# Altium project BMS029B.PrjPcb (part 1 of 2)
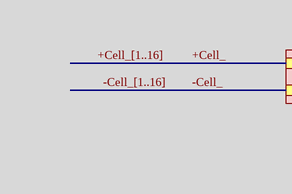
[diagram p0: BMS029B_Monitor.SchDoc, top left]
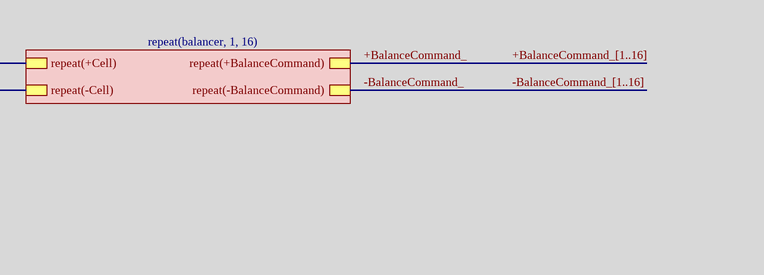
[diagram p1: BMS029B_Monitor.SchDoc, top right]
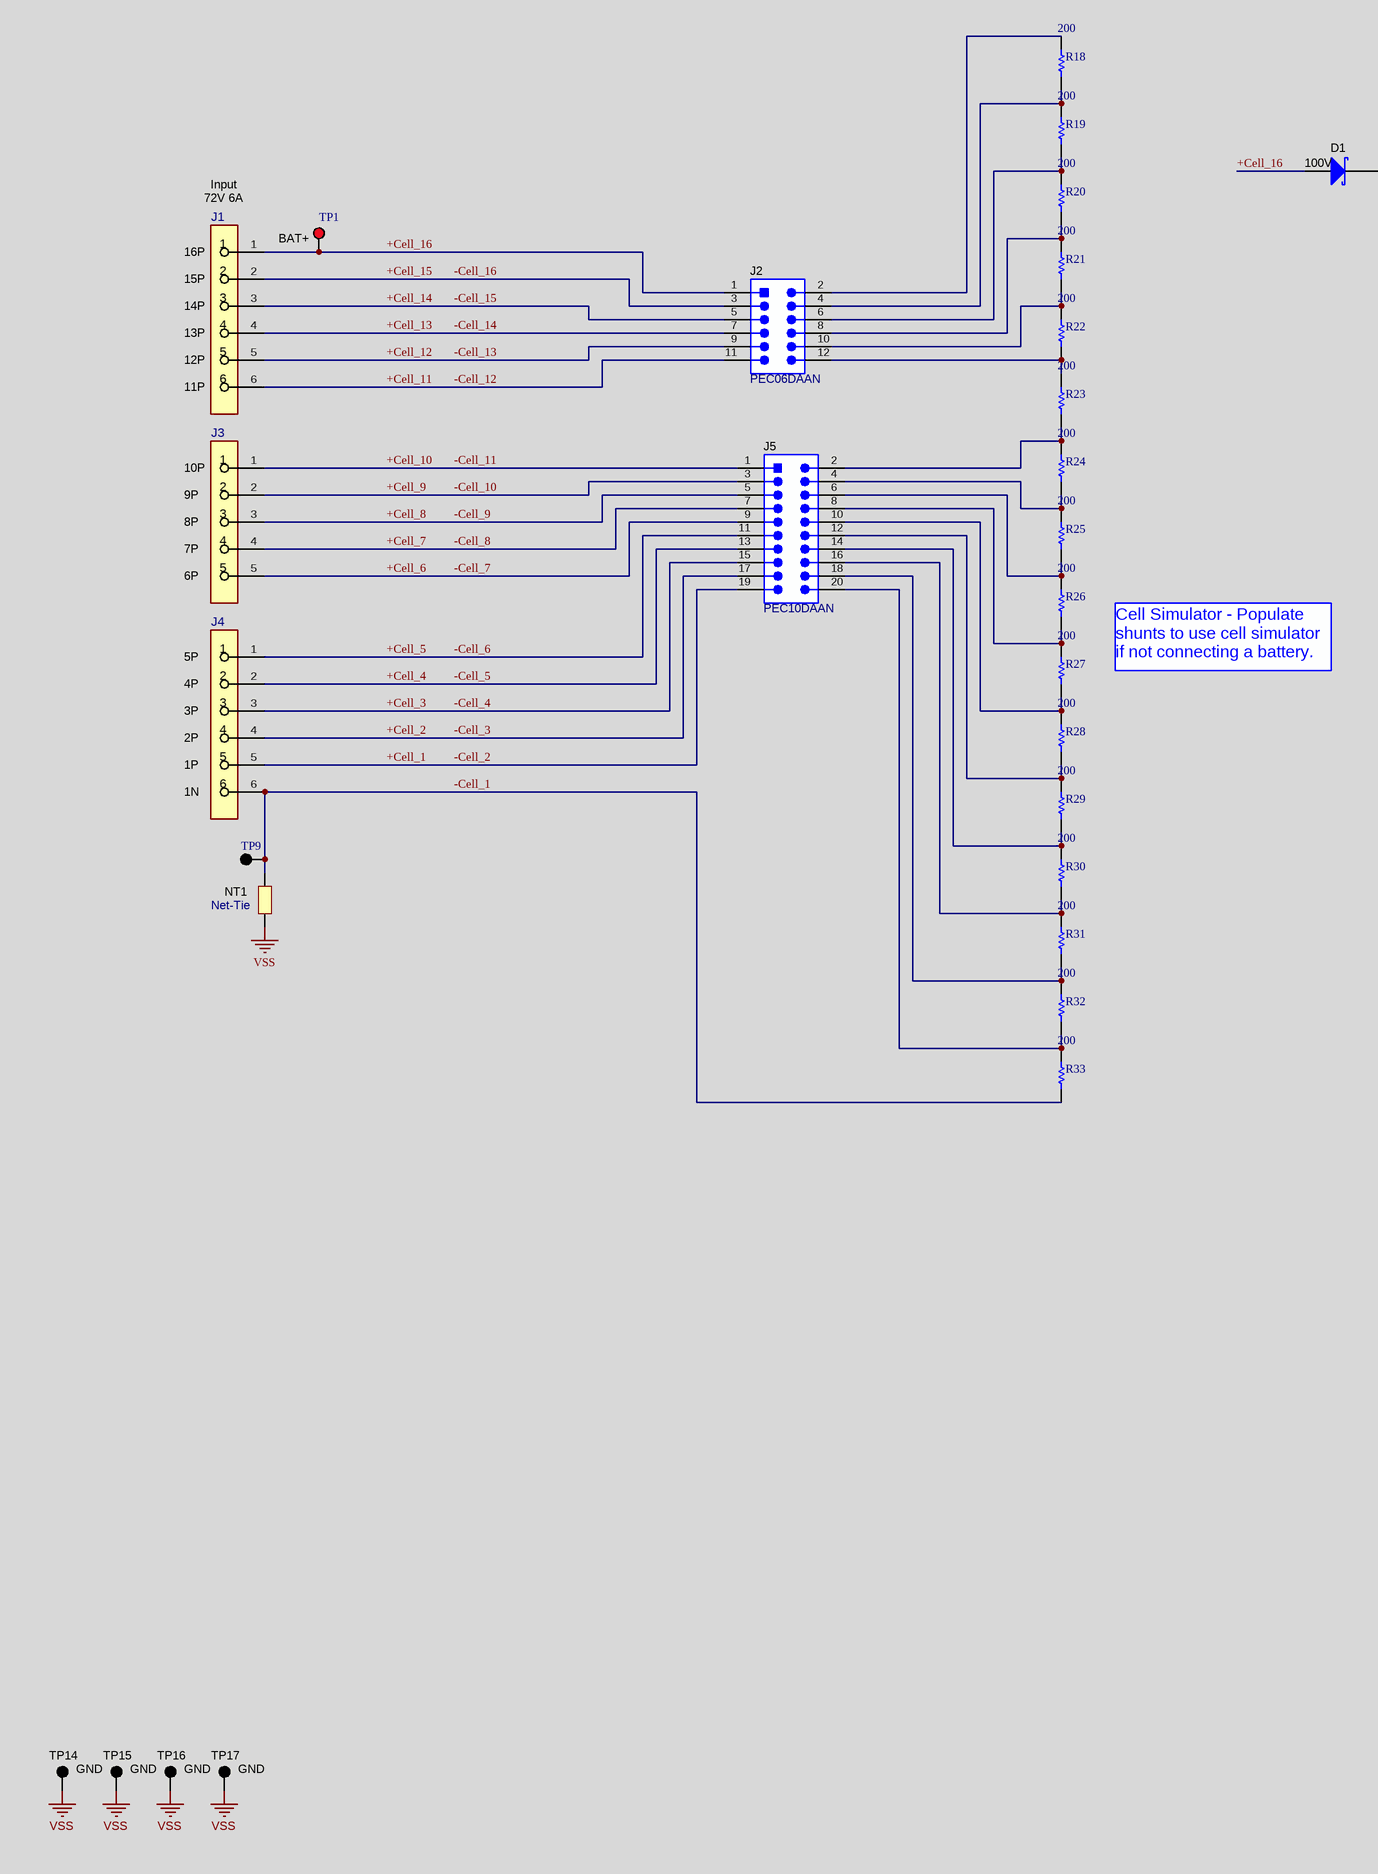
[diagram p2: BMS029B_Monitor.SchDoc, bottom left]
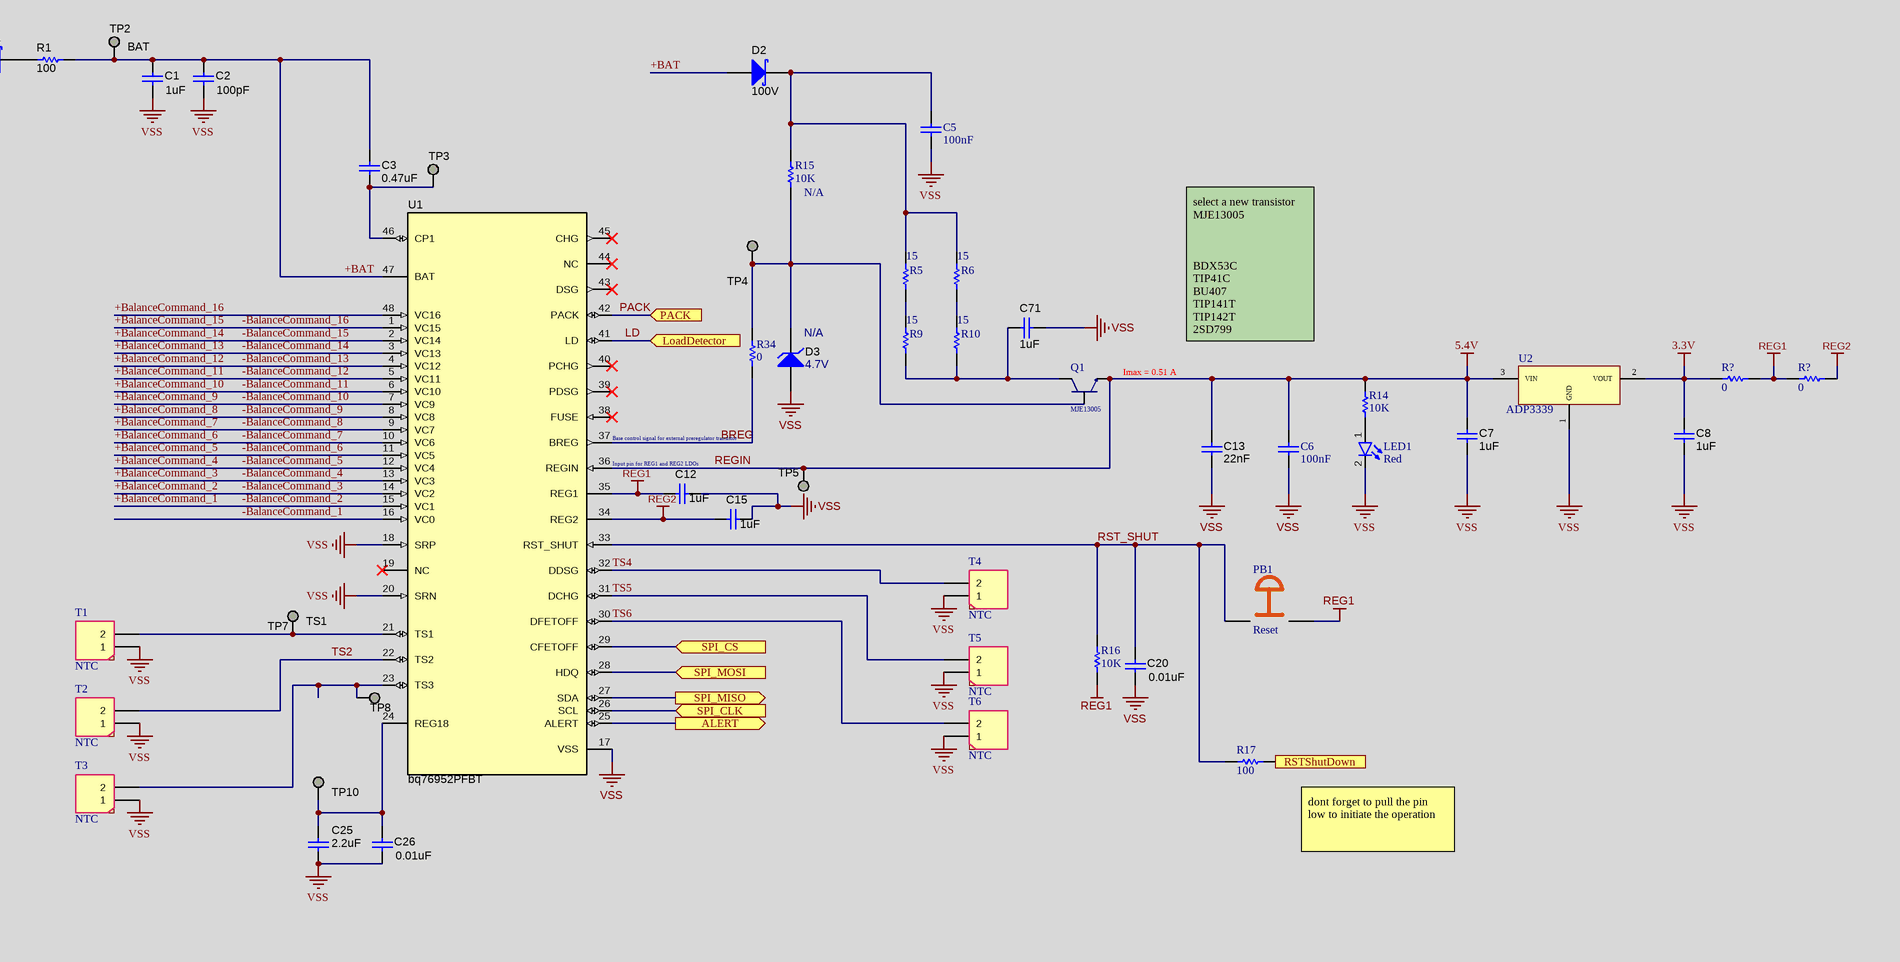
[diagram p3: BMS029B_Monitor.SchDoc, bottom right]
PCB_Rev: B; PRJ_Customer: Public Release; PRJ_Number: BMS029; PRJ_Title: BQ76952EVM; SCH_Rev: B; TID: N/A
4 sheets, 328 parts. Net scope: hierarchical (ports join the sheet entries above them; power ports are global).
Board file: BMS_slave.PcbDoc
Sheets:
  BMS029B_Monitor.SchDoc
    balancer1 = balancer.SchDoc
    balancer2 = balancer.SchDoc
    balancer3 = balancer.SchDoc
    balancer4 = balancer.SchDoc
    balancer5 = balancer.SchDoc
    balancer6 = balancer.SchDoc
    balancer7 = balancer.SchDoc
    balancer8 = balancer.SchDoc
    balancer9 = balancer.SchDoc
    balancer10 = balancer.SchDoc
    balancer11 = balancer.SchDoc
    balancer12 = balancer.SchDoc
    balancer13 = balancer.SchDoc
    balancer14 = balancer.SchDoc
    balancer15 = balancer.SchDoc
    balancer16 = balancer.SchDoc
  BMS029B_Interface.SchDoc
  BMS029B_Hardware.SchDoc

## Sheet BMS029B_Monitor.SchDoc: Monitor
size A1; Date: Not shown in title block; ApprovedBy: Not shown in title block; CheckedBy: Not shown in title block; Author: Not shown in title block; CompanyName: Not shown in title block; Engineer: Not shown in title block; Organization: Not shown in title block; Address1: Not shown in title block; Address2: Not shown in title block; Address3: Not shown in title block; Address4: Not shown in title block; DocumentNumber: 1; Revision: Use project parameter SCH_Rev; SheetNumber: 1; SheetTotal: 5; PageSetup: Record=PageOptions|CenterHorizontal=True|CenterVertical=True|PrintScale=1.00|XCorrection=1.00|YCorrection=1.00|PrintKind=0|BorderSize=5000000|LeftOffset=0|BottomOffset=0|Orientation=2|PaperLength=1000|PaperWidth=1000|Scale=100|PaperSource=15|PrintQuality=600|MediaType=1|DitherType=10|PaperKind=Letter|PrintScaleMode=1; CurrentTime: Not shown in title block; CurrentDate: Not shown in title block; Time: Not shown in title block; DocumentFullPathAndName: Not shown in title block; DocumentName: Not shown in title block; ModifiedDate: Not shown in title block; ImagePath: Not shown in title block

### Parts
(Parts that share a designator on the sheet are numbered #1, #2 ... from top to bottom, then left to right.)
C1  ValueDisplayed: 1uF  [1206_180]  (hidden comment: C3216X7R2A105K160AA)
C2  ValueDisplayed: 100pF  [0603]  (hidden comment: GCM1885C2A101JA16D)
C3  ValueDisplayed: 0.47uF  [0805_HV]  (hidden comment: GCM219R71E474KA55D)
C5  100nF  [CAPC0603]
C6  100nF  [CAPC0603]
C7  ValueDisplayed: 1uF  [0805_HV]  (hidden comment: EMK212B7105KG-T)
C8  ValueDisplayed: 1uF  [0805_HV]  (hidden comment: EMK212B7105KG-T)
C12  ValueDisplayed: 1uF  [0805_HV]  (hidden comment: EMK212B7105KG-T)
C13  Cap_F: 22nF  [0603]  (hidden comment: C0603C223K4RACTU)
C15  ValueDisplayed: 1uF  [0805_HV]  (hidden comment: EMK212B7105KG-T)
C20  ValueDisplayed: 0.01uF  [0603]  (hidden comment: 885012206040)
C25  ValueDisplayed: 2.2uF  [0805_HV]  (hidden comment: EMK212B7225KG-T)
C26  ValueDisplayed: 0.01uF  [0603]  (hidden comment: 885012206040)
C71  ValueDisplayed: 1uF  [1206_180]  (hidden comment: C3216X7R2A105K160AA)
D1  value 100V  [SOD-123]  (hidden comment: BAT46W-7-F)
D2  value 100V  [SOD-123]  (hidden comment: BAT46W-7-F)
D3  N/A  value 4.7V  [ZENER]
J1  OSTTE060161  [FP-OSTTE060161_HDR6-MFG]  (value not drawn)
J2  PEC06DAAN  [CONN_PEC06DAAN]
J3  OSTTE050161  [FP-OSTTE050161_HDR5-MFG]  (value not drawn)
J4  OSTTE060161  [FP-OSTTE060161_HDR6-MFG]  (value not drawn)
J5  PEC10DAAN  [SULLINS_PEC10DAAN]
LED1  Red  [LED SMD 1206]
NT1  Net-Tie  [Net-Tie_10milWide_30milLong]  (net tie, no BOM)
PB1  Reset  [SWITCH-PB4]
Q1  Transistor: MJE13005  [dpak]  (hidden comment: NPN transistor)
R1  ValueDisplayed: 100  [0603]  (hidden comment: Resistor)
R5  15  [RES2512]
R6  15  [RESC0603]
R9  15  [RESC0603]
R10  15  [RESC0603]
R14  10K  [RES0603]
R15  N/A  value 10K  [RES0603]
R16  10K  [RES0603]
R17  100  [RES0603]
R18  200  [RESC0603]
R19  200  [RESC0603]
R20  200  [RESC0603]
R21  200  [RESC0603]
R22  200  [RESC0603]
R23  200  [RESC0603]
R24  200  [RESC0603]
R25  200  [RESC0603]
R26  200  [RESC0603]
R27  200  [RESC0603]
R28  200  [RESC0603]
R29  200  [RESC0603]
R30  200  [RESC0603]
R31  200  [RESC0603]
R32  200  [RESC0603]
R33  200  [RESC0603]
R34  0  [RES0603]
R?#1  0  [RES0603]
R?#2  0  [RES0603]
T1  NTC  [HEADER1*2]
T2  NTC  [HEADER1*2]
T3  NTC  [HEADER1*2]
T4  NTC  [HEADER1*2]
T5  NTC  [HEADER1*2]
T6  NTC  [HEADER1*2]
TP1  TESTPOINT  [Keystone5010]  (value not drawn)
TP2  TESTPOINT  [TP_VIA_060RND040]  (value not drawn)  (no BOM)
TP3  TESTPOINT  [TP_VIA_060RND040]  (value not drawn)  (no BOM)
TP4  TESTPOINT  [TP_VIA_060RND040]  (value not drawn)  (no BOM)
TP5  TESTPOINT  [TP_VIA_060RND040]  (value not drawn)  (no BOM)
TP7  TESTPOINT  [TP_VIA_060RND040]  (value not drawn)  (no BOM)
TP8  TESTPOINT  [TP_VIA_060RND040]  (value not drawn)  (no BOM)
TP9  TESTPOINT  [Keystone5011]  (value not drawn)
TP10  TESTPOINT  [TP_50MIL-25MILHOLE]  (value not drawn)  (no BOM)
TP14  5006  [Keystone5006]  (value not drawn)
TP15  5006  [Keystone5006]  (value not drawn)
TP16  5006  [Keystone5006]  (value not drawn)
TP17  5006  [Keystone5006]  (value not drawn)
U1  bq76952PFBT  [PFB0048A_N]
U2  ADP3339  [AMS1117]

### Sub-sheets
repeat(balancer, 1, 16) = balancer.SchDoc: repeat(+Cell), repeat(+BalanceCommand), repeat(-Cell), repeat(-BalanceCommand)

### Ports
ALERT (out), LoadDetector (in), PACK (in), RSTShutDown (in), SPI_CLK (in), SPI_CS (in), SPI_MISO (out), SPI_MOSI (in)

### Nets
3.3V: C8.2 R?#1.1 U2.2(VOUT)
REG1: C12.2 PB1.2 R16.2 R?#1.2 R?#2.1 U1.35(REG1)
REG2: C15.2 R?#2.2 U1.34(REG2)
REGIN: C6.2 C7.2 C13.2 Q1.2(E) R14.1 TP5.1 U1.36(REGIN) U2.3(VIN)  [also labelled 5.4V]
VSS: C1.2 C2.2 C5.1 C6.1 C7.1 C8.1 C12.1 C13.1 C15.1 C20.2 C25.1 C26.2 C71.2 D3.2(A) LED1.2(K) NT1.1 T1.1 T2.1 T3.1 T4.1 T5.1 T6.1 TP14.1 TP15.1 TP16.1 TP17.1 U1.17(VSS) U1.18(SRP) U1.20(SRN) U2.1(GND)
+BalanceCommand_: sheet repeat(balancer, 1, 16)/repeat(+BalanceCommand)
+BalanceCommand_1: U1.15(VC1)  [also labelled -BalanceCommand_2]
+BalanceCommand_2: U1.14(VC2)  [also labelled -BalanceCommand_3]
+BalanceCommand_3: U1.13(VC3)  [also labelled -BalanceCommand_4]
+BalanceCommand_4: U1.12(VC4)  [also labelled -BalanceCommand_5]
+BalanceCommand_5: U1.11(VC5)  [also labelled -BalanceCommand_6]
+BalanceCommand_6: U1.10(VC6)  [also labelled -BalanceCommand_7]
+BalanceCommand_7: U1.9(VC7)  [also labelled -BalanceCommand_8]
+BalanceCommand_8: U1.8(VC8)  [also labelled -BalanceCommand_9]
+BalanceCommand_9: U1.7(VC9)  [also labelled -BalanceCommand_10]
+BalanceCommand_10: U1.6(VC10)  [also labelled -BalanceCommand_11]
+BalanceCommand_11: U1.5(VC11)  [also labelled -BalanceCommand_12]
+BalanceCommand_12: U1.4(VC12)  [also labelled -BalanceCommand_13]
+BalanceCommand_13: U1.3(VC13)  [also labelled -BalanceCommand_14]
+BalanceCommand_14: U1.2(VC14)  [also labelled -BalanceCommand_15]
+BalanceCommand_15: U1.1(VC15)  [also labelled -BalanceCommand_16]
+BalanceCommand_16: U1.48(VC16)
+BAT: C1.1 C2.1 C3.1 D2.2(A) R1.1 TP2.1 U1.47(BAT)
+Cell_: sheet repeat(balancer, 1, 16)/repeat(+Cell)
+Cell_1: J4.5 J5.19  [also labelled -Cell_2]
+Cell_2: J4.4 J5.17  [also labelled -Cell_3]
+Cell_3: J4.3 J5.15  [also labelled -Cell_4]
+Cell_4: J4.2 J5.13  [also labelled -Cell_5]
+Cell_5: J4.1 J5.11  [also labelled -Cell_6]
+Cell_6: J3.5 J5.9  [also labelled -Cell_7]
+Cell_7: J3.4 J5.7  [also labelled -Cell_8]
+Cell_8: J3.3 J5.5  [also labelled -Cell_9]
+Cell_9: J3.2 J5.3  [also labelled -Cell_10]
+Cell_10: J3.1 J5.1  [also labelled -Cell_11]
+Cell_11: J1.6 J2.11  [also labelled -Cell_12]
+Cell_12: J1.5 J2.9  [also labelled -Cell_13]
+Cell_13: J1.4 J2.7  [also labelled -Cell_14]
+Cell_14: J1.3 J2.5  [also labelled -Cell_15]
+Cell_15: J1.2 J2.3  [also labelled -Cell_16]
+Cell_16: D1.2(A) J1.1 J2.1 TP1.1
-BalanceCommand_: sheet repeat(balancer, 1, 16)/repeat(-BalanceCommand)
-BalanceCommand_1: U1.16(VC0)
-Cell_: sheet repeat(balancer, 1, 16)/repeat(-Cell)
-Cell_1: J4.6 NT1.2 R33.1 TP9.1
ALERT: U1.25(ALERT) ; port ALERT
BREG: R34.2 U1.37(BREG)
LD: U1.41(LD) ; port LoadDetector
PACK: U1.42(PACK) ; port PACK
RST_SHUT: C20.1 PB1.1 R16.1 R17.1 U1.33(RST_SHUT)
RSTShutDown: R17.2 ; port RSTShutDown
SPI_CLK: U1.26(SCL) ; port SPI_CLK
SPI_CS: U1.29(CFETOFF) ; port SPI_CS
SPI_MISO: U1.27(SDA) ; port SPI_MISO
SPI_MOSI: U1.28(HDQ) ; port SPI_MOSI
TS2: T2.2 U1.22(TS2)
TS4: T4.2 U1.32(DDSG)
TS5: T5.2 U1.31(DCHG)
TS6: T6.2 U1.30(DFETOFF)
NetC3_2: C3.2 TP3.1 U1.46(CP1)
NetC5_2: C5.2 D2.1(K) R5.2 R6.2 R15.1
NetC25_2: C25.2 C26.1 TP10.1 U1.24(REG18)
NetC71_1: C71.1 Q1.3(C) R9.1 R10.1
NetD1_1: D1.1(K) R1.2
NetD3_1: D3.1(K) Q1.1(B) R15.2 R34.1 TP4.1
NetJ2_2: J2.2 R18.2
NetJ2_4: J2.4 R18.1 R19.2
NetJ2_6: J2.6 R19.1 R20.2
NetJ2_8: J2.8 R20.1 R21.2
NetJ2_10: J2.10 R21.1 R22.2
NetJ2_12: J2.12 R22.1 R23.2
NetJ5_2: J5.2 R23.1 R24.2
NetJ5_4: J5.4 R24.1 R25.2
NetJ5_6: J5.6 R25.1 R26.2
NetJ5_8: J5.8 R26.1 R27.2
NetJ5_10: J5.10 R27.1 R28.2
NetJ5_12: J5.12 R28.1 R29.2
NetJ5_14: J5.14 R29.1 R30.2
NetJ5_16: J5.16 R30.1 R31.2
NetJ5_18: J5.18 R31.1 R32.2
NetJ5_20: J5.20 R32.1 R33.2
NetLED1_1: LED1.1(A) R14.2
NetR5_1: R5.1 R9.2
NetR6_1: R6.1 R10.2
NetT1_2: T1.2 TP7.1 U1.21(TS1)
NetT3_2: T3.2 TP8.1 U1.23(TS3)

Not connected (* = marked no-connect by the designer): U1 19(NC)* 38(FUSE)* 39(PDSG)* 40(PCHG)* 43(DSG)* 44(NC)* 45(CHG)*

### Buses and harness runs
bus +BalanceCommand_[1..16]
bus +Cell_[1..16]
bus -BalanceCommand_[1..16]
bus -Cell_[1..16]

### Notes on the sheet
- Input
- BAT
- (near J1) 16P
- (near J1) 72V 6A
- (near TP1) BAT+
- (near J1) 15P
- (near J1) 14P
- (near J1) 13P
- (near J1) 12P
- (near J1) 11P
- (near J3) 9P
- (near J3) 8P
- (near J3) 10P
- (near Q1) Imax = 0.51 A
- select a new transistor
  MJE13005
  BDX53C
  TIP41C
  BU407
  TIP141T
  TIP142T
  2SD799
- (near J3) 6P
- (near J3) 7P
- (near U1) Base control signal for external preregulator transistor
- (near J4) 5P
- Input pin for REG1 and REG2 LDOs
- (near J4) 4P
- (near J4) 3P
- Cell Simulator - Populate shunts to use cell simulator if not connecting a battery.
- (near J4) 2P
- (near J4) 1P
- (near J4) 1N
- (near TP7) TS1
- (near R17) dont forget to pull the pin low to initiate the operation
- GND
- (near TP17) GND

### Library data of the parts
C1 C71 = CMP-0008710-2: CAP, CERM, 1 uF, 100 V, +/- 10%, X7R, 1206; Manufacturer: TDK; TaMin_C: -55°C; ESR_ohm: 4.575m; Polarized: N; SizeAreaWB_mm2: 10.92; Value1: 0.004575 ohm; U/M: EA; Value: 1uF; TaMax_C: 125°C; SizeZ_mm: 1.8; SizeX_mm: 3.2; SizeY_mm: 1.6; Value2: 100V; SizeArea_mm2: 5.12; Cap_F: 1µF; IRMS_A: 3.39639A; AEC Category: Q200; Supplier Part Number 2: 810-C3216X7R2A105K160AA; Publisher: Texas Instruments; Supplier 2: Mouser; TempCo: X7R; Published: 2008-06-19; RoHS: Y; MountType: SMT; Supplier 1: Digi-Key; PackageReference: 1206; Tolerance_%: 10%; Cap_Case: 1206_180; CompType: Capacitor; LatestRevisionDate: 2017-03-09; PartNumber: C3216X7R2A105K160AA; AEC Qualified: N; VDC_V: 100V; ComponentLink1Description: Datasheet link; AEC Grade: N/A; Supplier Part Number 1: 445-4467-1-ND; Technology: Ceramic; ComponentLink1URL: https://product.tdk.com/en/search/capacitor/ceramic/mlcc/info?part_no=C3216X7R2A105K160AA
C2 = CMP-0007130-4: CAP, CERM, 100 pF, 100 V, +/- 5%, C0G/NP0, AEC-Q200 Grade 1, 0603; Manufacturer: MuRata; TaMin_C: -55°C; Polarized: N; SizeAreaWB_mm2: 4.68; Value1: Unknown; U/M: EA; TaMax_C: 125°C; SizeZ_mm: 1; SizeX_mm: 1.6; SizeY_mm: 0.8; Value2: 100V; SizeArea_mm2: 1.28; AEC Qualified: Y; AEC Category: Q200; Value: 100pF; Supplier Part Number 2: 81-GCM1885C2A101JA6D; Publisher: Texas Instruments; Supplier 2: Mouser; TempCo: C0G/NP0; Published: 2008-06-19; RoHS: Y; MountType: SMT; Supplier 1: Digi-Key; PackageReference: 0603; Tolerance_%: 5%; Cap_Case: 0603; CompType: Capacitor; LatestRevisionDate: 2017-03-09; PartNumber: GCM1885C2A101JA16D; Cap_F: 100pF; VDC_V: 100V; ComponentLink1Description: Datasheet link; AEC Grade: 1; Supplier Part Number 1: 490-4771-1-ND; Technology: Ceramic; ComponentLink1URL: http://psearch.murata.com/capacitor/product/GCM1885C2A101JA16%23.pdf
C3 = CMP-0008010-2: CAP, CERM, 0.47 uF, 25 V, +/- 10%, X7R, AEC-Q200 Grade 1, 0805; Manufacturer: MuRata; TaMin_C: -55°C; Polarized: N; SizeAreaWB_mm2: 6.75; Value1: Unknown; U/M: EA; Value: 0.47uF; TaMax_C: 125°C; SizeZ_mm: 1.45; SizeX_mm: 2; SizeY_mm: 1.25; Cap_Case: 0805; Value2: 25V; SizeArea_mm2: 2.5; AEC Qualified: Y; Cap_F: 470nF; AEC Grade: 1; AEC Category: Q200; Supplier Part Number 2: 81-GCM219R71E474KA5D; Publisher: Texas Instruments; Supplier 2: Mouser; TempCo: X7R; Published: 2008-06-19; RoHS: Y; MountType: SMT; Supplier 1: Digi-Key; PackageReference: 0805; Tolerance_%: 10%; CompType: Capacitor; LatestRevisionDate: 2017-03-09; PartNumber: GCM219R71E474KA55D; VDC_V: 25V; ComponentLink1Description: Datasheet link; Supplier Part Number 1: 490-8044-1-ND; Technology: Ceramic; ComponentLink1URL: http://psearch.murata.com/capacitor/product/GCM219R71E474KA55%23.pdf
C5 C6 = Capacitor: Published: 8-Jun-2000; LatestRevisionDate: 17-Jul-2002; LatestRevisionNote: Re-released for DXP Platform.; PackageReference: C0805; Publisher: Altium Limited; Value: 100nF
C7 C8 C12 C15 = CMP-0008000-2: CAP, CERM, 1 uF, 16 V, +/- 10%, X7R, 0805; Manufacturer: Taiyo Yuden; TaMin_C: -55°C; Polarized: N; SizeAreaWB_mm2: 6.75; Value1: Unknown; U/M: EA; Value: 1uF; TaMax_C: 125°C; SizeZ_mm: 1.45; SizeX_mm: 2; SizeY_mm: 1.25; Cap_Case: 0805; Value2: 16V; SizeArea_mm2: 2.5; Cap_F: 1µF; AEC Category: Q200; Supplier Part Number 2: 1683653; Publisher: Texas Instruments; Supplier 2: Farnell; TempCo: X7R; Published: 2008-06-19; RoHS: Y; MountType: SMT; Supplier 1: Digi-Key; PackageReference: 0805; Tolerance_%: 10%; CompType: Capacitor; LatestRevisionDate: 2017-03-09; PartNumber: EMK212B7105KG-T; AEC Qualified: ?; VDC_V: 16V; ComponentLink1Description: Datasheet link; Supplier Part Number 1: 587-1283-1-ND; Technology: Ceramic; ComponentLink1URL: http://www.yuden.co.jp/ut/product/pdf/djmk_e.pdf
C13 = CMP-0006900-4: CAP, CERM, 0.022 uF, 16 V, +/- 10%, X7R, 0603; Manufacturer: Kemet; TaMin_C: -55°C; Polarized: N; SizeAreaWB_mm2: 4.68; Value1: Unknown; U/M: EA; TaMax_C: 125°C; SizeZ_mm: 1; SizeX_mm: 1.6; SizeY_mm: 0.8; Value2: 16V; SizeArea_mm2: 1.28; AEC Category: Q200; Supplier Part Number 2: 80-C0603C223K4R; Publisher: Texas Instruments; Supplier 2: Mouser; TempCo: X7R; Published: 2008-06-19; RoHS: Y; MountType: SMT; Value: 0.022uF; Supplier 1: Digi-Key; PackageReference: 0603; Tolerance_%: 10%; Cap_Case: 0603; CompType: Capacitor; LatestRevisionDate: 2017-03-09; PartNumber: C0603C223K4RACTU; AEC Qualified: ?; VDC_V: 16V; ComponentLink1Description: Datasheet link; Supplier Part Number 1: 399-1093-1-ND; Technology: Ceramic; ValueDisplayed: 0.022uF; ComponentLink1URL: http://www.kemet.com/kemet/web/homepage/kechome.nsf/vapubfiles/F3102_Y5V.pdf/$file/F3102_Y5V.pdf; Supplier 3: Farnell; Supplier Part Number 3: 1204523
C20 C26 = CMP-0006828-4: CAP, CERM, 0.01 uF, 16 V, +/- 10%, X7R, 0603; Manufacturer: Wurth Elektronik; TaMin_C: -55°C; Polarized: N; SizeAreaWB_mm2: 4.68; Value1: Unknown; U/M: EA; Value: 0.01uF; TaMax_C: 125°C; SizeZ_mm: 1; SizeX_mm: 1.6; SizeY_mm: 0.8; Value2: 16V; SizeArea_mm2: 1.28; Cap_F: 10nF; AEC Category: Q200; Supplier Part Number 2: 710-885012206040; Publisher: Texas Instruments; Supplier 2: Mouser; TempCo: X7R; Published: 2008-06-19; RoHS: Y; MountType: SMT; Supplier 1: Digi-Key; PackageReference: 0603; Tolerance_%: 10%; Cap_Case: 0603; CompType: Capacitor; LatestRevisionDate: 2017-03-09; PartNumber: 885012206040; AEC Qualified: N; VDC_V: 16V; ComponentLink1Description: Datasheet link; AEC Grade: N/A; Supplier Part Number 1: 732-7959-1-ND; Technology: Ceramic; ComponentLink1URL: http://katalog.we-online.de/pbs/datasheet/885012206040.pdf
C25 = CMP-0008001-2: CAP, CERM, 2.2 uF, 16 V, +/- 10%, X7R, 0805; Manufacturer: Taiyo Yuden; TaMin_C: -55°C; Polarized: N; SizeAreaWB_mm2: 6.75; Value1: Unknown; U/M: EA; Value: 2.2uF; TaMax_C: 125°C; SizeZ_mm: 1.45; SizeX_mm: 2; SizeY_mm: 1.25; Cap_Case: 0805; Value2: 16V; SizeArea_mm2: 2.5; Cap_F: 2.2µF; AEC Category: Q200; Supplier Part Number 2: 1683654; Publisher: Texas Instruments; Supplier 2: Farnell; TempCo: X7R; Published: 2008-06-19; RoHS: Y; MountType: SMT; Supplier 1: Digi-Key; PackageReference: 0805; Tolerance_%: 10%; CompType: Capacitor; LatestRevisionDate: 2017-03-09; PartNumber: EMK212B7225KG-T; AEC Qualified: ?; VDC_V: 16V; ComponentLink1Description: Datasheet link; Supplier Part Number 1: 587-1431-1-ND; Technology: Ceramic; ComponentLink1URL: http://www.yuden.co.jp/ut/product/pdf/djmk_e.pdf
D1 D2 = CMP-0028450-2: Diode, Schottky, 100 V, 0.15 A, SOD-123; Manufacturer: Diodes Inc.; Io_A: 150mA; SizeArea_mm2: 6.545; SizeX_mm: 3.85; Value2: 0.6V; Value1: 0.15A; AEC Category: Q101; SizeZ_mm: 1.35; SizeY_mm: 1.7; Green_Lifecycle: Active; Green_REACh: Passed; SizeAreaWB_mm2: 13.095; Vf_V: 600mV; ComponentLink1Description: Datasheet link; MountType: SMT; ComponentLink1URL: http://www.diodes.com/datasheets/ds30044.pdf; Vr_V: 100V; PartNumber: BAT46W-7-F; Type: Schottky; AEC Qualified: ?; Green_EU RoHS-2: Passed; Green_EU RoHS: Passed; CompType: Diode; RoHS: Y; PackageReference: SOD-123
D3 = CMP-0005740-3: Diode, Zener, 4.7 V, 500 mW; Manufacturer: ON Semiconductor; PartNumber: MMSZ4697T1G; SizeY_mm: 1.7; SizeX_mm: 3.85; RJA_CperW: 340; SizeAreaWB_mm2: 13.095; AEC Category: Q101; Power_W: 500mW; SizeZ_mm: 1.35; Vz_V: 10V; Value1: 0.5W; SizeArea_mm2: 6.545; PackageReference: SOD-123; AEC Qualified: ?; MountType: SMT; RoHS: Y; ComponentLink1Description: Datasheet link; CompType: Zener; ComponentLink1URL: http://www.onsemi.com/pub_link/Collateral/MMSZ4678T1-D.PDF
J1 J4 = CMP-0087050-1: TERM BLOCK 3.5MM VERT 6POS PCB; Manufacturer: On Shore Technology; ContactFinish: Tin; Current_A: 10A; Voltage_V: 300V; Row_Count: 1; PinCount: 6; RoHS: TRUE; ComponentLink1URL: http://www.on-shore.com/wp-content/uploads/2019/02/OSTTEXX0161.pdf; ComponentLink1Description: Datasheet; PartNumber: OSTTE060161; Symbol Name: SYM-OSTTE060161; PackageReference: HDR6
J2 = CMP-0054551-2: Header, 100mil, 6x2, Tin, TH; Manufacturer: Sullins Connector Solutions; Current_A: 3A; Green_Lifecycle: Not Set; Shrouded: N; Gender: Male; Green_REACh: Incomplete; Voltage_V: 1.8kV; Row_Count: 2; RowSpacing_mm: 2.54; Cert_UL: Y; ComponentLink1URL: http://www.sullinscorp.com/catalogs/77_PAGE108-109_.100_MALE_HDR.pdf; ClassName: Header; Color: Black; RoHS: Y; MountType: TH; Green_EU RoHS-2: Incomplete; Supplier 1: Digi-Key; Green_EU RoHS: Incomplete; PackageReference: Header, 6x2, 100mil, Tin; PinCount: 12; CompType: Header; PartNumber: PEC06DAAN; Orientation: Vertical; ComponentLink1Description: Datasheet URL; Supplier Part Number 1: S2012E-06-ND; Pitch_mm: 2.54; ContactFinish: Tin
J3 = CMP-0087049-1: TERM BLOCK 3.5MM VERT 5POS PCB; Manufacturer: On Shore Technology; Row_Count: 1; ContactFinish: Tin; Current_A: 10A; Voltage_V: 300V; ComponentLink1Description: Datasheet; PinCount: 5; PartNumber: OSTTE050161; RoHS: TRUE; PackageReference: HDR5; Symbol Name: SYM-OSTTE050161; ComponentLink1URL: http://www.on-shore.com/wp-content/uploads/2019/02/OSTTEXX0161.pdf
J5 = CMP-0054623-2: Header, 2.54mm, 10x2, Tin, TH; Manufacturer: Sullins Connector Solutions; Current_A: 3A; Green_Lifecycle: Not Set; Shrouded: N; Gender: Male; Green_REACh: Incomplete; Row_Count: 2; RowSpacing_mm: 2.54; Cert_UL: Y; ComponentLink1URL: https://drawings-pdf.s3.amazonaws.com/C10419.pdf; ClassName: Header; Color: Black; RoHS: Y; MountType: TH; Green_EU RoHS-2: Incomplete; Supplier 1: Digi-Key; Green_EU RoHS: Incomplete; PackageReference: Header, 10x2, 2.54mm, TH; PinCount: 20; CompType: Header; PartNumber: PEC10DAAN; Orientation: Vertical; ComponentLink1Description: Datasheet URL; Supplier Part Number 1: S2012E-10-ND; Pitch_mm: 2.54; ContactFinish: Tin
LED1 = LED: Designer: Saeid Jorablo; Organazation: ControTec; Adding Date: 1387/12/22; Color: Red; Size: SMD 0603
NT1 = CMP-0078142-3: Single point connection between nets.; MountType: SMT; PackageReference: N/A; CompType: Net-Tie; Library Reference: Net-Tie; Manufacturer: N/A; PartNumber: N/A
PB1 = Swtich-PB4: 4-Pin Push Button
Q1 = BC817: 45 V, 0.5 A
R1 = CMP-0025700-4: RES, 100, 5%, 0.1 W, AEC-Q200 Grade 0, 0603; PartNumber: CRCW0603100RJNEA; Manufacturer: Vishay-Dale; Value: 100; Value_Code: 100R; Power_W: 100mW; Value2: 0.1W; VDC_V: 75V; TempCo: 200 ppm/C; EIA_Code: E24; U/M: EA; SizeArea_mm2: 1.28; SizeX_mm: 1.6; SizeY_mm: 0.8; SizeZ_mm: 1; AEC Category: Q200; AEC Qualified: Y; AEC Grade: 0; CompType: Resistor; SymbolVersion: 2009-05-29; PackageReference: 0603; RoHS: E; Res_ohm: 100; Tolerance_%: 5%; Value1: 5%; MountType: SMT; Technology: Thick Film; Published: 2008-06-26; Publisher: Texas Instruments; LatestRevisionDate: 2017-06-13; ComponentLink1Description: Datasheet link; ComponentLink1URL: http://www.vishay.com/docs/20035/dcrcwe3.pdf; Supplier 1: Digi-Key; Supplier Part Number 1: 541-100GCT-ND; Supplier 2: Newark; Supplier Part Number 2: 59M6764; Supplier 3: Mouser; Supplier Part Number 3: 71-CRCW0603J-100-E3
R5 R6 R9 R10 = Resistor_2: 0603,0.1W; Value: 15; PackageReference: AXIAL-0.5; Published: 8-Jun-2000; LatestRevisionDate: 17-Jul-2002; LatestRevisionNote: Re-released for DXP Platform.; Publisher: Altium Limited
R14-R17 R34 R?#1 R?#2 = Res: Resistor; Published: 8-Jun-2000; LatestRevisionDate: 17-Jul-2002; LatestRevisionNote: Re-released for DXP Platform.; PackageReference: AXIAL-0.3; Publisher: Altium Limited; PackageDescription: Axial Device, Thru-Hole; 2 Leads; 0.3 in Pin Spacing
  R14 R16: Value: 10K
  R17: Value: 100
  R34 R?#1 R?#2: Value: 0
R18-R33 = Resistor: 0603,0.1W; Value: 200; PackageReference: AXIAL-0.5; Published: 8-Jun-2000; LatestRevisionDate: 17-Jul-2002; LatestRevisionNote: Re-released for DXP Platform.; Publisher: Altium Limited
T1-T6 = Header1*2: Header, 2-Pin temperature sensor
TP1 = CMP-0055147-1: Test Point, Multipurpose, Red, TH; Manufacturer: Keystone; CNHeader: FALSE; Green_Lifecycle: Active; Green_REACh: Passed; ContactFinish: Silver; CT: TRUE; CompType: Test Point; PackageReference: Red Multipurpose Testpoint; PartNumber: 5010; ComponentLink1URL: http://www.keyelco.com/userAssets/file/M60-2p60.pdf; Supplier Part Number 2: 534-5010; Publisher: Texas Instruments; Supplier 2: Mouser; Color: Red; RoHS: Y; MountType: TH; Green_EU RoHS-2: Incomplete; Supplier 1: Digi-Key; Green_EU RoHS: Passed; LatestRevisionDate: 26/05/2017; ComponentLink1Description: Datasheet URL; Supplier Part Number 1: 36-5010-ND
TP2-TP5 TP7 TP8 TP10 = CMP-0078143-2: TEST POINT.  No entry in BOM.; PartNumber: N/A; CompType: Testpoint; Manufacturer: N/A; PackageReference: N/A; Library Reference: TESTPOINT
TP9 = CMP-0055148-1: Test Point, Multipurpose, Black, TH; Manufacturer: Keystone; CNHeader: FALSE; Green_Lifecycle: Active; Green_REACh: Passed; ContactFinish: Silver; CT: TRUE; CompType: Test Point; PackageReference: Black Multipurpose Testpoint; PartNumber: 5011; ComponentLink1URL: http://www.keyelco.com/userAssets/file/M60-2p60.pdf; Supplier Part Number 2: 534-5011; Publisher: Texas Instruments; Supplier 2: Mouser; Color: Black; RoHS: Y; MountType: TH; Green_EU RoHS-2: Incomplete; Supplier 1: Digi-Key; Green_EU RoHS: Passed; LatestRevisionDate: 26/05/2017; ComponentLink1Description: Datasheet URL; Supplier Part Number 1: 36-5011-ND
TP14-TP17 = CMP-0055143-1: Test Point, Compact, Black, TH; Manufacturer: Keystone; ContactFinish: Silver; Green_Lifecycle: Active; Green_REACh: Passed; CNHeader: FALSE; CT: TRUE; SymbolVersion: 2008-04-04; PartNumber: 5006; CompType: Test Point; RoHS: Y; PackageReference: Black Compact Testpoint; MountType: TH; ComponentLink1Description: Datasheet URL; ComponentLink1URL: http://www.keyelco.com/userAssets/file/M60-2p60.pdf; Publisher: Texas Instruments; LatestRevisionDate: 26/05/2017; Supplier 1: Digi-Key; Supplier Part Number 1: 36-5006-ND; Supplier 2: Mouser; Supplier Part Number 2: 534-5006; Color: Black; Green_EU RoHS: Passed; Green_EU RoHS-2: Incomplete
U1 = CMP-0084229-1: Multicell Battery Monitor and Protection Family, PFB0048A (TQFP-48); Alternate PartNumber: bq76952PFBR; Alternate Manufacturer: Texas Instruments; SizeAreaWB_mm2: 121; SizeZ_mm: 1.2; SizeX_mm: 9; SizeArea_mm2: 81; CompType: IC; AEC Qualified: N; AEC Category: Q200; ComponentLink1URL: http://www.ti.com/lit/ds/symlink/bq76952.pdf; PackageDescription: TQFP-48; MountType: SMT; ComponentLink2URL: http://www.ti.com/product/bq76952; ComponentLink3Description: Online Datasheet; ComponentLink2Description: Product Folder; Manufacturer: Texas Instruments; ComponentLink3URL: http://www.ti.com/product/bq76952/datasheet; PackageReference: PFB0048A; SizeY_mm: 9; PartNumber: bq76952PFBT; ComponentLink1Description: Datasheet Link
U2 = AMS1117: High Accuracy, Ultralow IQ, 1.5 A, anyCAP Low Dropout Regulator

## Sheet balancer.SchDoc
size A
Used 16 times, as channels balancer1, balancer2, balancer3, balancer4, balancer5, balancer6, balancer7, balancer8, balancer9, balancer10, balancer11, balancer12, balancer13, balancer14, balancer15, balancer16. Parts and nets are listed once, with the designators drawn on the sheet.
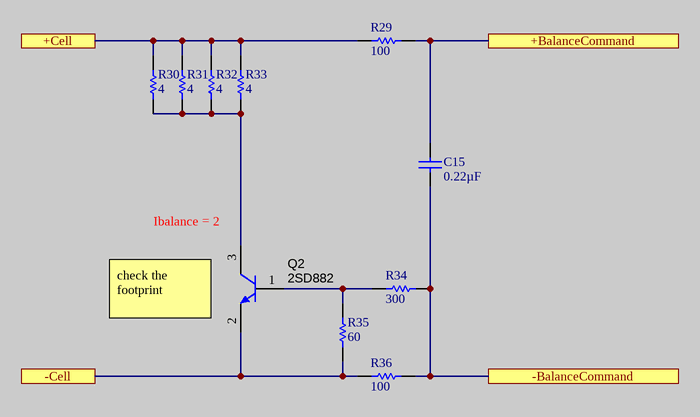
[diagram p4: balancer.SchDoc]

### Parts
C15  0.22µF  [CAPC0603]
Q2  2SD882  [dpak]
R29  100  [RESC0603]
R30  4  [RES2512]
R31  4  [RES2512]
R32  4  [RES2512]
R33  4  [RES2512]
R34  300  [RESC0603]
R35  60  [RESC0603]
R36  100  [RESC0603]

### Ports
+BalanceCommand, +Cell, -BalanceCommand, -Cell

### Nets
+BalanceCommand: C15.2 R29.2 ; port +BalanceCommand
+Cell: R29.1 R30.1 R31.1 R32.1 R33.1 ; port +Cell
-BalanceCommand: C15.1 R34.2 R36.2 ; port -BalanceCommand
-Cell: Q2.2(E) R35.1 R36.1 ; port -Cell
NetQ2_1: Q2.1(B) R34.1 R35.2
NetQ2_3: Q2.3(C) R30.2 R31.2 R32.2 R33.2

### Channels
balancer1: designators end in A; ports +BalanceCommand=+BalanceCommand_1 +Cell=+Cell_1 -BalanceCommand=-BalanceCommand_1 -Cell=-Cell_1
balancer2: designators end in B; ports +BalanceCommand=+BalanceCommand_2 +Cell=+Cell_2 -BalanceCommand=+BalanceCommand_1 -Cell=+Cell_1
balancer3: designators end in C; ports +BalanceCommand=+BalanceCommand_3 +Cell=+Cell_3 -BalanceCommand=+BalanceCommand_2 -Cell=+Cell_2
balancer4: designators end in D; ports +BalanceCommand=+BalanceCommand_4 +Cell=+Cell_4 -BalanceCommand=+BalanceCommand_3 -Cell=+Cell_3
balancer5: designators end in E; ports +BalanceCommand=+BalanceCommand_5 +Cell=+Cell_5 -BalanceCommand=+BalanceCommand_4 -Cell=+Cell_4
balancer6: designators end in F; ports +BalanceCommand=+BalanceCommand_6 +Cell=+Cell_6 -BalanceCommand=+BalanceCommand_5 -Cell=+Cell_5
balancer7: designators end in G; ports +BalanceCommand=+BalanceCommand_7 +Cell=+Cell_7 -BalanceCommand=+BalanceCommand_6 -Cell=+Cell_6
balancer8: designators end in H; ports +BalanceCommand=+BalanceCommand_8 +Cell=+Cell_8 -BalanceCommand=+BalanceCommand_7 -Cell=+Cell_7
balancer9: designators end in I; ports +BalanceCommand=+BalanceCommand_9 +Cell=+Cell_9 -BalanceCommand=+BalanceCommand_8 -Cell=+Cell_8
balancer10: designators end in J; ports +BalanceCommand=+BalanceCommand_10 +Cell=+Cell_10 -BalanceCommand=+BalanceCommand_9 -Cell=+Cell_9
balancer11: designators end in K; ports +BalanceCommand=+BalanceCommand_11 +Cell=+Cell_11 -BalanceCommand=+BalanceCommand_10 -Cell=+Cell_10
balancer12: designators end in L; ports +BalanceCommand=+BalanceCommand_12 +Cell=+Cell_12 -BalanceCommand=+BalanceCommand_11 -Cell=+Cell_11
balancer13: designators end in M; ports +BalanceCommand=+BalanceCommand_13 +Cell=+Cell_13 -BalanceCommand=+BalanceCommand_12 -Cell=+Cell_12
balancer14: designators end in N; ports +BalanceCommand=+BalanceCommand_14 +Cell=+Cell_14 -BalanceCommand=+BalanceCommand_13 -Cell=+Cell_13
balancer15: designators end in O; ports +BalanceCommand=+BalanceCommand_15 +Cell=+Cell_15 -BalanceCommand=+BalanceCommand_14 -Cell=+Cell_14
balancer16: designators end in P; ports +BalanceCommand=+BalanceCommand_16 +Cell=+Cell_16 -BalanceCommand=+BalanceCommand_15 -Cell=+Cell_15

### Notes on the sheet
- (near Q2) Ibalance = 2
- (near Q2) check the footprint

### Library data of the parts
C15 = Capacitor: Published: 8-Jun-2000; LatestRevisionDate: 17-Jul-2002; LatestRevisionNote: Re-released for DXP Platform.; PackageReference: C0805; Publisher: Altium Limited; Value: 0.22µF
Q2 = BSR14, Nexperia: BJT 30V 3A 40V 10W SI-NPN; PartNumber: BSR14; U/M: EA; Value1: 0.8 A; Value2: 300; SizeAreaWB_mm2: 14; SizeArea_mm2: 7.5; SizeX_mm: 2.5; SizeY_mm: 3; SizeZ_mm: 1.1; AEC Category: Q101; PNP: 0; NPN: 1; Vceo_V: 40; Vcesat1_V: 0.3; IcRated_A: 0.8; TaMin_C: -65; TaMax_C: 150; SymbolVersion: 2008-07-31; CompType: BJT; Manufacturer: Nexperia; PackageReference: SOT-23; Value: 40 V; RoHS: Y; MountType: SMT; Published: 2008-07-31; Publisher: Texas Instruments; LatestRevisionDate: 2017-06-09; ComponentLink1Description: Datasheet link; ComponentLink1URL: http://www.nexperia.com/documents/data_sheet/BSR13_BSR14.pdf; Supplier 1: Digi-Key; Supplier Part Number 1: 568-6225-1-ND; AEC Qualified: ?; HfeMax: 300
R29-R36 = Resistor: 0603,0.1W; Published: 8-Jun-2000; LatestRevisionDate: 17-Jul-2002; LatestRevisionNote: Re-released for DXP Platform.; PackageReference: AXIAL-0.5; Publisher: Altium Limited
  R29 R36: Value: 100
  R30-R33: Value: 4
  R34: Value: 300
  R35: Value: 60